# EAGLE board omicron2 (EAGLE 6.3)
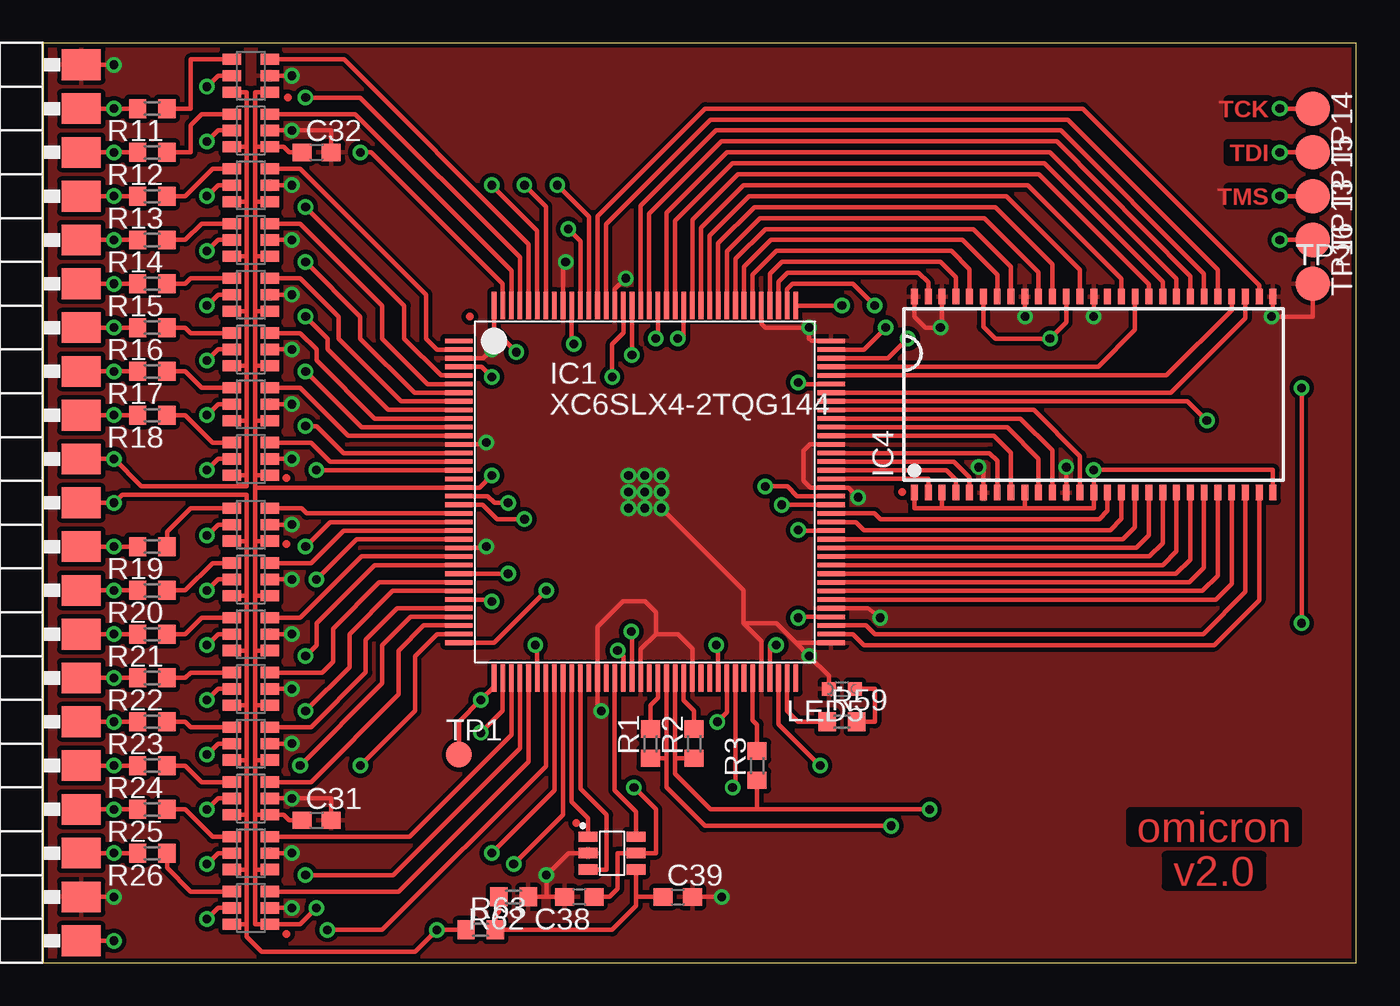
[diagram p5: board, top side]
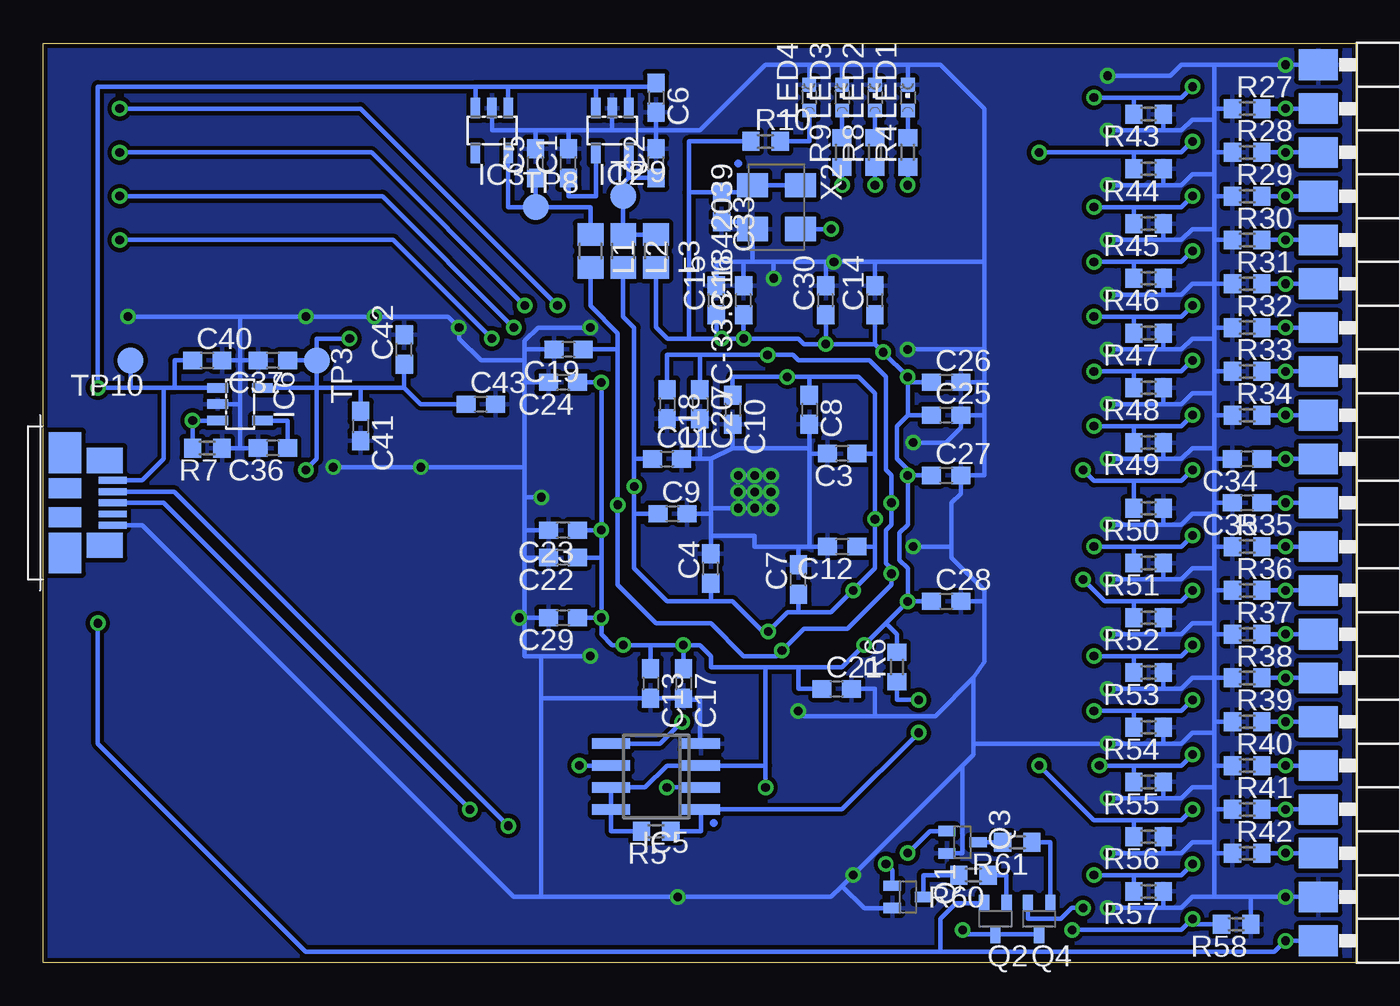
[diagram p6: board, bottom side, seen from below]

Size 76.19 x 53.33 mm. Coordinates in mm from the lower left corner, seen from the top.
Outline: 76.19,0 76.19,53.33 0,53.33 0,0 76.19,0
Copper layers (1*16): Top 0.035mm / dielectric 1.5mm / Bottom 0.035mm
Design rules "default *": minimum track width 0.2mm, minimum drill 0.5mm, track to track 0.2mm, track to pad 0.2mm, pad to pad 0.2mm, via to via 0.2mm, smd to smd 0mil, copper to edge 0.2mm, drill to drill 8mil, minimum pad ring 0.2mm, minimum via ring 0.2mm, stop-mask expansion 4mil, vias tented up to drill 1mm, thermal gap 10mil

## Footprints (pad centres in the part's own frame; a part is rotated, then mirrored left to right if it is on the bottom)
C0603 = smd 1.1 x 1: 1 -0.85,0; 2 0.85,0
TQG144 = smd 1.6 x 0.27: 1 -10.8,8.75; 2 -10.8,8.25; 3 -10.8,7.75; 4 -10.8,7.25; 5 -10.8,6.75; 6 -10.8,6.25; 7 -10.8,5.75; 8 -10.8,5.25; 9 -10.8,4.75; 10 -10.8,4.25; 11 -10.8,3.75; 12 -10.8,3.25; 13 -10.8,2.75; 14 -10.8,2.25; 15 -10.8,1.75; 16 -10.8,1.25; 17 -10.8,0.75; 18 -10.8,0.25; 19 -10.8,-0.25; 20 -10.8,-0.75; 21 -10.8,-1.25; 22 -10.8,-1.75; 23 -10.8,-2.25; 24 -10.8,-2.75; 25 -10.8,-3.25; 26 -10.8,-3.75; 27 -10.8,-4.25; 28 -10.8,-4.75; 29 -10.8,-5.25; 30 -10.8,-5.75; 31 -10.8,-6.25; 32 -10.8,-6.75; 33 -10.8,-7.25; 34 -10.8,-7.75; 35 -10.8,-8.25; 36 -10.8,-8.75; 73 10.8,-8.75; 74 10.8,-8.25; 75 10.8,-7.75; 76 10.8,-7.25; 77 10.8,-6.75; 78 10.8,-6.25; 79 10.8,-5.75; 80 10.8,-5.25; 81 10.8,-4.75; 82 10.8,-4.25; 83 10.8,-3.75; 84 10.8,-3.25; 85 10.8,-2.75; 86 10.8,-2.25; 87 10.8,-1.75; 88 10.8,-1.25; 89 10.8,-0.75; 90 10.8,-0.25; 91 10.8,0.25; 92 10.8,0.75; 93 10.8,1.25; 94 10.8,1.75; 95 10.8,2.25; 96 10.8,2.75; 97 10.8,3.25; 98 10.8,3.75; 99 10.8,4.25; 100 10.8,4.75; 101 10.8,5.25; 102 10.8,5.75; 103 10.8,6.25; 104 10.8,6.75; 105 10.8,7.25; 106 10.8,7.75; 107 10.8,8.25; 108 10.8,8.75 | smd 0.27 x 1.6: 37 -8.75,-10.8; 38 -8.25,-10.8; 39 -7.75,-10.8; 40 -7.25,-10.8; 41 -6.75,-10.8; 42 -6.25,-10.8; 43 -5.75,-10.8; 44 -5.25,-10.8; 45 -4.75,-10.8; 46 -4.25,-10.8; 47 -3.75,-10.8; 48 -3.25,-10.8; 49 -2.75,-10.8; 50 -2.25,-10.8; 51 -1.75,-10.8; 52 -1.25,-10.8; 53 -0.75,-10.8; 54 -0.25,-10.8; 55 0.25,-10.8; 56 0.75,-10.8; 57 1.25,-10.8; 58 1.75,-10.8; 59 2.25,-10.8; 60 2.75,-10.8; 61 3.25,-10.8; 62 3.75,-10.8; 63 4.25,-10.8; 64 4.75,-10.8; 65 5.25,-10.8; 66 5.75,-10.8; 67 6.25,-10.8; 68 6.75,-10.8; 69 7.25,-10.8; 70 7.75,-10.8; 71 8.25,-10.8; 72 8.75,-10.8; 109 8.75,10.8; 110 8.25,10.8; 111 7.75,10.8; 112 7.25,10.8; 113 6.75,10.8; 114 6.25,10.8; 115 5.75,10.8; 116 5.25,10.8; 117 4.75,10.8; 118 4.25,10.8; 119 3.75,10.8; 120 3.25,10.8; 121 2.75,10.8; 122 2.25,10.8; 123 1.75,10.8; 124 1.25,10.8; 125 0.75,10.8; 126 0.25,10.8; 127 -0.25,10.8; 128 -0.75,10.8; 129 -1.25,10.8; 130 -1.75,10.8; 131 -2.25,10.8; 132 -2.75,10.8; 133 -3.25,10.8; 134 -3.75,10.8; 135 -4.25,10.8; 136 -4.75,10.8; 137 -5.25,10.8; 138 -5.75,10.8; 139 -6.25,10.8; 140 -6.75,10.8; 141 -7.25,10.8; 142 -7.75,10.8; 143 -8.25,10.8; 144 -8.75,10.8
SOT23-DBV = smd 0.55 x 1.2: 1 -0.95,-1.3; 2 0,-1.3; 3 0.95,-1.3; 4 0.95,1.3; 5 -0.95,1.3
TSOP54-400 = smd 0.4 x 0.9: 1 -10.4,-5.68; 2 -9.6,-5.68; 3 -8.8,-5.68; 4 -8,-5.68; 5 -7.2,-5.68; 6 -6.4,-5.68; 7 -5.6,-5.68; 8 -4.8,-5.68; 9 -4,-5.68; 10 -3.2,-5.68; 11 -2.4,-5.68; 12 -1.6,-5.68; 13 -0.8,-5.68; 14 0,-5.68; 15 0.8,-5.68; 16 1.6,-5.68; 17 2.4,-5.68; 18 3.2,-5.68; 19 4,-5.68; 20 4.8,-5.68; 21 5.6,-5.68; 22 6.4,-5.68; 23 7.2,-5.68; 24 8,-5.68; 25 8.8,-5.68; 26 9.6,-5.68; 27 10.4,-5.68; 28 10.4,5.68; 29 9.6,5.68; 30 8.8,5.68; 31 8,5.68; 32 7.2,5.68; 33 6.4,5.68; 34 5.6,5.68; 35 4.8,5.68; 36 4,5.68; 37 3.2,5.68; 38 2.4,5.68; 39 1.6,5.68; 40 0.8,5.68; 41 0,5.68; 42 -0.8,5.68; 43 -1.6,5.68; 44 -2.4,5.68; 45 -3.2,5.68; 46 -4,5.68; 47 -4.8,5.68; 48 -5.6,5.68; 49 -6.4,5.68; 50 -7.2,5.68; 51 -8,5.68; 52 -8.8,5.68; 53 -9.6,5.68; 54 -10.4,5.68
SO8 = smd 0.6 x 2.2: 1 -1.905,-2.6; 2 -0.635,-2.6; 3 0.635,-2.6; 4 1.905,-2.6; 5 1.905,2.6; 6 0.635,2.6; 7 -0.635,2.6; 8 -1.905,2.6
PINH1X01SMD = smd 1.778 x 2.286: 1 0,-2.223
R0805 = smd 1.3 x 1.5: 1 -0.95,0; 2 0.95,0
CHIPLED_0603 = smd 0.8 x 0.8: A 0,-0.75; C 0,0.75
SOT323 = smd 0.6 x 1: 1 -0.65,-0.9; 2 0.65,-0.9; 3 0,0.9
SOT323-BEC = smd 0.6 x 1: 1 -0.65,-0.9; 2 0.65,-0.9; 3 0,0.9
R0603 = smd 1 x 1.1: 1 -0.85,0; 2 0.85,0
TP15R = smd 1.5 x 1.5: TP 0,0
TP20R = smd 2 x 2: TP 0,0
SOT236 = smd 0.65 x 1.06: 1 -0.95,-1.1; 2 0,-1.1; 3 0.95,-1.1; 4 0.95,1.1; 5 0,1.1; 6 -0.95,1.1
SOT23 = smd 0.6 x 1.1: 1 -0.95,-1.4; 2 0,-1.4; 3 0.95,-1.4; 4 0.95,1.4; 5 0,1.4; 6 -0.95,1.4
USB-MICRO-B-BOTTOM-MOLEX = smd 1.6 x 0.4: 1 2.77,1.3; 2 2.77,0.65; 3 2.77,0; 4 2.77,-0.65; 5 2.77,-1.3 | smd 1.9 x 2.375: S@1 0,2.913; S@4 0,-2.913 | smd 1.9 x 1.175: S@2 0,0.838; S@3 0,-0.838 | smd 2.1 x 1.475: S@5 2.3,2.462; S@6 2.3,-2.462
5X3.2_HAND = smd 1.4 x 1.8: 1 -1.27,-1.4; 2 1.27,-1.4; 3 1.27,1.4; 4 -1.27,1.4

## Placement (x,y rotation side)
C1  10uF  [C0603]  45.71,46.35 90 bottom
C2  2.2uF  [C0603]  40.63,46.35 90 bottom
C3  4.7uF  [C0603]  29.83,29.53 180 bottom
C4  4.7uF  [C0603]  37.46,22.86 90 bottom
C5  1uF  [C0603]  47.62,46.35 90 bottom
C6  2.2uF  [C0603]  40.63,50.16 270 bottom
C7  4.7uF  [C0603]  32.38,22.23 90 bottom
C8  4.7uF  [C0603]  31.74,32.07 270 bottom
C9  4.7uF  [C0603]  39.68,26.04 0 bottom
C10  4.7uF  [C0603]  36.19,32.07 270 bottom
C11  4.7uF  [C0603]  40,29.21 0 bottom
C12  470nF  [C0603]  29.83,24.13 180 bottom
C13  4.7uF  [C0603]  40.95,16.19 270 bottom
C14  4.7uF  [C0603]  27.93,38.42 90 bottom
C15  470nF  [C0603]  37.14,38.42 90 bottom
C16  470nF  [C0603]  35.55,38.42 90 bottom
C17  470nF  [C0603]  39.04,16.19 270 bottom
C18  4.7uF  [C0603]  40,32.38 270 bottom
C19  4.7uF  [C0603]  45.71,35.56 180 bottom
C20  470nF  [C0603]  38.09,32.38 270 bottom
C21  470nF  [C0603]  30.15,15.88 0 bottom
C22  4.7uF  [C0603]  46.03,23.5 180 bottom
C23  470nF  [C0603]  46.03,25.08 180 bottom
C24  470nF  [C0603]  46.03,33.66 180 bottom
C25  4.7uF  [C0603]  23.8,31.75 0 bottom
C26  470nF  [C0603]  23.8,33.66 0 bottom
C27  470nF  [C0603]  23.8,28.26 0 bottom
C28  470nF  [C0603]  23.8,20.95 0 bottom
C29  470nF  [C0603]  46.03,20 180 bottom
C30  470nF  [C0603]  30.79,38.42 90 bottom
C31  470nF  [C0603]  15.87,8.26 0 top
C32  470nF  [C0603]  15.87,46.99 0 top
C33  470nF  [C0603]  36.82,43.81 270 bottom
C34  [C0603]  6.34,29.21 180 bottom
C35  [C0603]  6.34,26.67 180 bottom
C36  10uF  [C0603]  62.86,29.84 180 bottom
C37  2.2uF  [C0603]  62.86,34.92 180 bottom
C38  470nF  [C0603]  31.1,3.81 180 top
C39  470nF  [C0603]  36.82,3.81 0 top
C40  2.2uF  [C0603]  66.66,34.92 0 bottom
C41  470nF  [C0603]  57.77,31.11 270 bottom
C42  470nF  [C0603]  55.23,35.56 90 bottom
C43  470nF  [C0603]  50.79,32.38 0 bottom
IC1  XC6SLX4-2TQG144  [TQG144]  34.91,27.3 0 top
IC2  TPS73033DBV  [SOT23-DBV]  43.17,48.26 180 bottom
IC3  LD6806TD/12H  [SOT23-DBV]  50.16,48.26 180 bottom
IC4  MT48LC64M4A2  [TSOP54-400]  60.95,32.94 0 top
IC5  M25P40-2253716  [SO8]  40.63,10.79 90 bottom
IC6  TPS73033DBV  [SOT23-DBV]  64.76,32.38 270 bottom
JP1  PINH1X01SMD  [PINH1X01SMD]  -0.01,26.67 270 bottom
JP2  PINH1X01SMD  [PINH1X01SMD]  -0.01,26.67 90 top
JP3  PINH1X01SMD  [PINH1X01SMD]  -0.01,29.21 270 bottom
JP4  PINH1X01SMD  [PINH1X01SMD]  -0.01,29.21 90 top
JP5  PINH1X01SMD  [PINH1X01SMD]  -0.01,3.81 270 bottom
JP6  PINH1X01SMD  [PINH1X01SMD]  -0.01,3.81 90 top
JP7  PINH1X01SMD  [PINH1X01SMD]  -0.01,52.07 270 bottom
JP8  PINH1X01SMD  [PINH1X01SMD]  -0.01,52.07 90 top
JP9  PINH1X01SMD  [PINH1X01SMD]  -0.01,1.27 90 top
JP10  PINH1X01SMD  [PINH1X01SMD]  -0.01,1.27 270 bottom
JP97  PINH1X01SMD  [PINH1X01SMD]  -0.01,24.13 90 top
JP98  PINH1X01SMD  [PINH1X01SMD]  -0.01,24.13 270 bottom
JP99  PINH1X01SMD  [PINH1X01SMD]  -0.01,21.59 270 bottom
JP100  PINH1X01SMD  [PINH1X01SMD]  -0.01,21.59 90 top
JP101  PINH1X01SMD  [PINH1X01SMD]  -0.01,19.05 270 bottom
JP102  PINH1X01SMD  [PINH1X01SMD]  -0.01,19.05 90 top
JP103  PINH1X01SMD  [PINH1X01SMD]  -0.01,16.51 270 bottom
JP104  PINH1X01SMD  [PINH1X01SMD]  -0.01,16.51 90 top
JP105  PINH1X01SMD  [PINH1X01SMD]  -0.01,13.97 270 bottom
JP106  PINH1X01SMD  [PINH1X01SMD]  -0.01,13.97 90 top
JP107  PINH1X01SMD  [PINH1X01SMD]  -0.01,11.43 270 bottom
JP108  PINH1X01SMD  [PINH1X01SMD]  -0.01,11.43 90 top
JP109  PINH1X01SMD  [PINH1X01SMD]  -0.01,8.89 270 bottom
JP110  PINH1X01SMD  [PINH1X01SMD]  -0.01,8.89 90 top
JP111  PINH1X01SMD  [PINH1X01SMD]  -0.01,6.35 270 bottom
JP112  PINH1X01SMD  [PINH1X01SMD]  -0.01,6.35 90 top
JP113  PINH1X01SMD  [PINH1X01SMD]  -0.01,49.53 270 bottom
JP114  PINH1X01SMD  [PINH1X01SMD]  -0.01,49.53 90 top
JP115  PINH1X01SMD  [PINH1X01SMD]  -0.01,46.99 270 bottom
JP116  PINH1X01SMD  [PINH1X01SMD]  -0.01,46.99 90 top
JP117  PINH1X01SMD  [PINH1X01SMD]  -0.01,44.45 270 bottom
JP118  PINH1X01SMD  [PINH1X01SMD]  -0.01,44.45 90 top
JP119  PINH1X01SMD  [PINH1X01SMD]  -0.01,41.91 270 bottom
JP120  PINH1X01SMD  [PINH1X01SMD]  -0.01,41.91 90 top
JP121  PINH1X01SMD  [PINH1X01SMD]  -0.01,39.37 270 bottom
JP122  PINH1X01SMD  [PINH1X01SMD]  -0.01,39.37 90 top
JP123  PINH1X01SMD  [PINH1X01SMD]  -0.01,36.83 270 bottom
JP124  PINH1X01SMD  [PINH1X01SMD]  -0.01,36.83 90 top
JP125  PINH1X01SMD  [PINH1X01SMD]  -0.01,34.29 270 bottom
JP126  PINH1X01SMD  [PINH1X01SMD]  -0.01,34.29 90 top
JP127  PINH1X01SMD  [PINH1X01SMD]  -0.01,31.75 270 bottom
JP128  PINH1X01SMD  [PINH1X01SMD]  -0.01,31.75 90 top
L1  [R0805]  44.44,41.27 270 bottom
L2  [R0805]  42.54,41.27 270 bottom
L3  [R0805]  40.63,41.27 270 bottom
LED1  ORANGE-1710526  [CHIPLED_0603]  26.02,50.16 0 bottom
LED2  ORANGE-1710526  [CHIPLED_0603]  27.93,50.16 0 bottom
LED3  ORANGE-1710526  [CHIPLED_0603]  29.83,50.16 0 bottom
LED4  GREEN-1226372  [CHIPLED_0603]  31.74,50.16 0 bottom
LED5  RED  [CHIPLED_0603]  46.34,15.88 90 top
Q1  [SOT323]  26.02,3.81 270 bottom
Q2  BC807W  [SOT323-BEC]  20.94,2.54 180 bottom
Q3  [SOT323]  22.85,6.99 270 bottom
Q4  BC807W  [SOT323-BEC]  18.4,2.54 180 bottom
R1  27  [R0603]  35.23,12.7 90 top
R2  27  [R0603]  37.77,12.7 90 top
R3  1k5  [R0603]  41.42,11.43 90 top
R4  68  [R0603]  26.02,46.99 90 bottom
R5  47k  [R0603]  40.63,7.62 180 bottom
R6  4k7  [R0603]  26.66,17.14 90 bottom
R7  47k  [R0603]  66.66,29.84 180 bottom
R8  68  [R0603]  27.93,46.99 90 bottom
R9  68  [R0603]  29.83,46.99 90 bottom
R10  68  [R0603]  34.28,47.62 0 bottom
R11  [R0603]  6.34,49.53 180 top
R12  [R0603]  6.34,46.99 180 top
R13  [R0603]  6.34,44.45 180 top
R14  [R0603]  6.34,41.91 180 top
R15  [R0603]  6.34,39.37 180 top
R16  [R0603]  6.34,36.83 180 top
R17  [R0603]  6.34,34.29 180 top
R18  [R0603]  6.34,31.75 180 top
R19  [R0603]  6.34,24.13 180 top
R20  [R0603]  6.34,21.59 180 top
R21  [R0603]  6.34,19.05 180 top
R22  [R0603]  6.34,16.51 180 top
R23  [R0603]  6.34,13.97 180 top
R24  [R0603]  6.34,11.43 180 top
R25  [R0603]  6.34,8.89 180 top
R26  [R0603]  6.34,6.35 180 top
R27  [R0603]  6.34,49.53 0 bottom
R28  [R0603]  6.34,46.99 0 bottom
R29  [R0603]  6.34,44.45 0 bottom
R30  [R0603]  6.34,41.91 0 bottom
R31  [R0603]  6.34,39.37 0 bottom
R32  [R0603]  6.34,36.83 0 bottom
R33  [R0603]  6.34,34.29 0 bottom
R34  [R0603]  6.34,31.75 0 bottom
R35  [R0603]  6.34,24.13 0 bottom
R36  [R0603]  6.34,21.59 0 bottom
R37  [R0603]  6.34,19.05 0 bottom
R38  [R0603]  6.34,16.51 0 bottom
R39  [R0603]  6.34,13.97 0 bottom
R40  [R0603]  6.34,11.43 0 bottom
R41  [R0603]  6.34,8.89 0 bottom
R42  [R0603]  6.34,6.35 0 bottom
R43  [R0603]  12.05,49.21 180 bottom
R44  [R0603]  12.05,46.04 180 bottom
R45  [R0603]  12.05,42.86 180 bottom
R46  [R0603]  12.05,39.69 180 bottom
R47  [R0603]  12.05,36.51 180 bottom
R48  [R0603]  12.05,33.34 180 bottom
R49  [R0603]  12.05,30.16 180 bottom
R50  [R0603]  12.05,26.35 180 bottom
R51  [R0603]  12.05,23.18 180 bottom
R52  [R0603]  12.05,20 180 bottom
R53  [R0603]  12.05,16.83 180 bottom
R54  [R0603]  12.05,13.65 180 bottom
R55  [R0603]  12.05,10.48 180 bottom
R56  [R0603]  12.05,7.3 180 bottom
R57  [R0603]  12.05,4.13 180 bottom
R58  [R0603]  6.98,2.22 180 bottom
R59  68  [R0603]  46.34,13.97 0 top
R60  6k8 1%  [R0603]  22.21,5.08 180 bottom
R61  6k8 1%  [R0603]  19.67,6.99 180 bottom
R62  68  [R0603]  27.29,3.81 180 top
R63  68  [R0603]  25.39,1.91 0 top
TP1  TPTP15R  [TP15R]  24.12,12.06 0 top
TP2  TPTP20R  [TP20R]  73.65,39.37 0 top
TP3  TPTP15R  [TP15R]  60.32,34.92 270 bottom
TP8  TPTP15R  [TP15R]  47.62,43.81 0 bottom
TP9  TPTP15R  [TP15R]  42.54,44.45 0 bottom
TP10  TPTP15R  [TP15R]  71.11,34.92 180 bottom
TP13  TPTP20R  [TP20R]  73.65,44.45 270 top
TP14  TPTP20R  [TP20R]  73.65,49.53 270 top
TP15  TPTP20R  [TP20R]  73.65,46.99 270 top
TP16  TPTP20R  [TP20R]  73.65,41.91 270 top
TR1  [SOT236]  12.05,51.44 90 top
TR2  [SOT236]  12.05,48.26 90 top
TR3  [SOT236]  12.05,45.09 90 top
TR4  [SOT236]  12.05,41.91 90 top
TR5  [SOT236]  12.05,38.73 90 top
TR6  [SOT236]  12.05,35.56 90 top
TR7  [SOT236]  12.05,32.38 90 top
TR8  [SOT236]  12.05,29.21 90 top
TR9  [SOT236]  12.05,25.4 90 top
TR10  [SOT236]  12.05,22.23 90 top
TR11  [SOT236]  12.05,19.05 90 top
TR12  [SOT236]  12.05,15.88 90 top
TR13  [SOT236]  12.05,12.7 90 top
TR14  [SOT236]  12.05,9.53 90 top
TR15  [SOT236]  12.05,6.35 90 top
TR16  [SOT236]  12.05,3.17 90 top
U$1  PIC10F320  [SOT23]  33.01,6.35 270 top
X1  USB-MICRO-B-BOTTOM  [USB-MICRO-B-BOTTOM-MOLEX]  74.92,26.67 0 bottom
X2  7C-33.3-1842039  [5X3.2_HAND]  33.65,43.81 270 bottom

## Tracks (layer width: path | path; a pad name or v marks a point on that pad's centre or on a via)
+3V3  (via drill 0.5)
  Top 0.254: IC1.135 30.66,35.84 v30.79,35.88 | IC1.125 35.66,36.31 v35.55,36.2 | IC1.103 43.91,33.55 v43.8,33.66 | IC1.86 43.83,25.05 v43.8,25.08 | IC1.76 43.86,20.05 v43.8,20 | v28.56,18.41 28.66,18.32 IC1.42 28.66,17.78 | IC1.63 39.16,18.29 v39.04,18.41 | IC1.31 25.92,21.05 v26.02,20.95 | v26.02,28.26 25.32,27.55 IC1.18 12.29,27.55 | IC1.69 42.16,18.41 v42.54,18.41 | IC1.4 25.44,34.55 v26.02,33.97 | IC1.122 37.16,36.2 v36.82,36.2 | 12.29,5.4 12.29,2.23 TR16.1 14.92,2.23 v15.87,3.17 | TR15.1 12.29,5.4 | 12.29,8.57 TR14.1 13.96,8.57 14.28,8.26 C31.1 | 12.29,8.57 12.29,5.4 | TR13.1 12.29,11.75 | 12.29,11.75 12.29,8.57 | TR12.1 12.29,14.93 | 12.29,14.93 12.29,11.75 | TR11.1 12.29,18.1 | 12.29,18.1 12.29,14.93 | TR10.1 12.29,21.27 | 12.29,21.27 12.29,18.1 | 12.29,24.45 12.29,21.27 | TR8.1 12.29,28.26 | TR7.1 12.29,31.43 | 12.29,31.43 12.29,28.26 | TR6.1 12.29,34.61 | 12.29,34.61 12.29,31.43 | TR5.1 12.29,37.78 | 12.29,37.78 12.29,34.61 | TR4.1 12.29,40.96 | 12.29,40.96 12.29,37.78 | TR3.1 12.29,44.13 | 12.29,44.13 12.29,40.96 | 12.29,47.31 TR2.1 13.96,47.31 14.28,46.99 C32.1 | 12.29,47.31 12.29,44.13 | TR1.1 12.29,50.48 12.29,47.31 | IC1.144 26.16,36.69 v27.45,35.4 | TR9.1 12.29,24.45 | 12.29,24.45 12.29,27.55 | 12.29,27.55 12.29,28.26 | C38.1 32.85,3.81 33.33,4.29 33.33,6.35 U$1.5 35.55,6.35 35.55,8.89 v34.28,10.16
  Bottom 0.254: v30.79,35.88 C30.1 | v35.55,36.2 C16.1 | C24.1 v43.8,33.66 v43.8,25.08 | v43.8,25.08 C23.1 | v39.04,18.41 C17.1 | v26.02,20.95 C28.1 | v26.02,20.95 27.29,19.68 | 27.29,19.68 v28.56,18.41 29.83,17.14 32.38,17.14 | v26.02,33.97 26.02,33.66 | 26.02,33.66 26.02,31.75 | 40.95,18.41 v42.54,18.41 43.17,18.41 43.8,19.05 v43.8,20 | 40.95,18.41 v39.04,18.41 | v43.8,25.08 43.8,23.5 | 43.8,23.5 v43.8,20 | C25.1 26.02,31.75 | C22.1 43.8,23.5 | C26.1 26.02,33.66 | R5.2 43.23,7.62 IC5.8 IC5.7 41.27,10.16 40,11.43 IC5.3 34.28,11.43 | v39.04,18.41 38.09,18.41 37.46,17.78 37.46,17.14 34.28,17.14 | 26.02,34.29 v26.02,33.97 | v26.02,28.26 26.02,28.57 26.66,29.21 26.66,31.11 26.02,31.75 | v26.02,20.95 26.02,22.86 26.5,23.34 26.5,24.92 26.02,25.4 v26.02,28.26 | v30.79,35.88 32.06,35.88 32.38,36.2 v35.55,36.2 | v30.79,35.88 27.93,35.88 | 27.93,35.88 v27.45,35.4 v26.02,33.97 | C27.1 v26.02,28.26 | v35.55,36.2 v36.82,36.2 37.14,36.2 | C15.1 37.14,36.2 | 37.14,36.2 38.73,36.2 | 38.73,36.2 39.97,36.2 40.63,36.86 L3.2 | v43.8,20 C29.1 | X2.4 X2.1 35.05,44.66 C33.1 38.73,44.66 | C13.1 40.95,18.41 | 34.28,11.43 34.28,17.14 | C14.1 27.93,35.88 | 38.73,44.66 38.73,47.62 R10.1 | 38.73,44.66 38.73,36.2 | 34.28,17.14 32.38,17.14 | C21.1 32.38,15.88 32.38,17.14 | R6.2 26.66,19.05 27.29,19.68 | Q4.2 19.05,2.54 17.13,2.54 16.5,3.17 v15.87,3.17 | v34.28,10.16 34.28,11.43
+5V  (via drill 0.5)
  Top 0.254: JP9.1 v4.12,1.27 | v73.02,19.68 v73.02,33.34
  Bottom 0.254: JP9.1 v4.12,1.27 4.75,0.64 24.12,0.64 | IC3.1 49.21,50.8 | 49.21,50.8 51.11,50.8 | IC2.3 44.12,50.8 | 44.12,50.8 49.21,50.8 | IC2.1 42.22,50.8 | 42.22,50.8 44.12,50.8 | C6.1 40.63,50.8 42.22,50.8 | X1.1 70.44,27.97 69.2,29.21 69.2,33.34 | 68.57,33.34 69.2,33.34 | IC6.1 68.57,33.34 | 69.2,33.34 71.11,33.34 | 71.11,33.34 v73.02,33.34 73.02,50.8 51.11,50.8 | 51.11,50.8 IC3.3 | 24.12,0.64 60.95,0.64 73.02,12.7 v73.02,19.68 | TP10.TP 71.11,33.34 | C40.1 68.57,34.92 68.57,33.34 | Q2.2 23.22,3.44 24.12,2.54 24.12,0.64
AD_RA0
  Top 0.254: IC1.46 30.66,9.33 31.61,8.38 U$1.1
AD_RA1
  Top 0.254: U$1.3 32.69,5.4 32.69,8.57 31.16,10.1 IC1.47
AD_RA3
  Top 0.254: IC1.51 33.16,10.01 34.41,8.76 U$1.6
CFG_DONE
  Top 0.254: IC1.71 43.16,14.61 43.8,13.97 R59.1
CLK_33  (via drill 0.5)
  Top 0.254: IC1.134 31.16,41.85 v30.47,42.55
  Bottom 0.254: v30.47,42.55 X2.3
FLASH_CLK  (via drill 0.5)
  Top 0.254: IC1.70 42.66,13.84 v45.08,11.43
  Bottom 0.254: v45.08,11.43 IC5.6
FLASH_CS  (via drill 0.5)
  Top 0.254: IC1.38 26.66,14.61 v25.39,13.34
  Bottom 0.254: R5.1 38.03,7.62 IC5.1 29.83,8.89 v25.39,13.34
FLASH_SI  (via drill 0.5)
  Top 0.254: IC1.64 39.66,14.53 v39.12,13.97
  Bottom 0.254: IC5.5 40.39,12.7 v39.12,13.97
FLASH_SO  (via drill 0.5)
  Top 0.254: IC1.65 40.16,10.33 v40,10.16
  Bottom 0.254: IC5.2 v40,10.16
GND  (via drill 0.5)
  Top 0.254: IC1.3 25.52,35.05 v26.02,35.56 | IC1.13 25.6,30.05 v25.71,30.16 | IC1.25 25.63,24.05 v25.71,24.13 | IC1.60 37.66,18.2 36.82,19.05 35.55,19.05 | IC1.68 41.66,18.65 40.63,19.68 | 43.66,18.55 v44.44,17.78 45.59,16.62 LED5.C | 43.66,18.55 42.54,19.68 40.63,19.68 | IC1.73 43.66,18.55 | v47.3,26.99 46.73,27.55 IC1.91 44.51,27.55 44.12,27.94 44.12,29.69 44.49,30.05 IC1.96 | IC1.108 44.58,36.05 44.44,36.2 v44.44,36.83 41.9,36.83 41.66,37.06 IC1.113 | IC1.130 33.16,39.05 v33.8,39.69 | IC1.54 34.66,18.16 35.55,19.05 | IC1.77 47.85,20.55 v48.57,20 | TR1.2 v14.44,51.44 | TR2.2 v14.44,48.26 16.71,48.26 C32.2 | JP6.1 v4.12,3.81 | v4.12,52.07 JP8.1 | TR3.2 v14.44,45.09 | TR4.2 v14.44,41.91 | TR5.2 v14.44,38.73 | TR6.2 v14.44,35.56 | TR7.2 v14.44,32.38 | TR8.2 v14.44,29.21 | TR9.2 v14.44,25.4 | TR10.2 v14.44,22.23 | TR11.2 v14.44,19.05 | TR12.2 v14.44,15.88 | TR13.2 v14.44,12.7 | TR14.2 v14.44,9.53 16.71,9.53 C31.2 | TR15.2 v14.44,6.35 | TR16.2 v14.44,3.17 | IC4.46 56.95,37.47 v56.98,37.47 | IC4.41 v60.95,37.47 | IC4.54 50.55,37.47 51.19,36.83 v52.06,36.83 52.15,36.92 IC4.52 | IC4.28 71.35,37.47 v71.27,37.47 73.65,37.47 TP2.TP | IC4.12 v59.35,28.73 v59.36,28.73 | 40.63,19.68 40.63,21.59 v35.87,26.35 | 35.55,19.05 35.55,20.32 34.91,20.95 33.65,20.95 32.16,19.48 IC1.49 32.16,14.81 v32.38,14.61 | IC4.6 54.55,28.47 v54.28,28.73 | IC1.136 30.16,40.49 v30.31,40.64 | U$1.2 30.47,6.35 v29.2,5.08 29.2,3.81 | R62.1 29.2,3.81 | C38.2 29.2,3.81 | C39.2 v39.36,3.81
  Bottom 0.254: C7.2 32.38,24.13 | 32.38,24.13 31.74,24.13 | 31.74,24.13 C12.2 | 31.74,29.53 31.74,24.13 | C3.2 31.74,29.53 | C8.2 31.74,29.84 | 31.74,29.84 31.74,29.53 | 36.19,29.84 31.74,29.84 | C10.2 36.19,29.84 | 36.19,29.84 37.46,29.21 | 37.46,29.21 38.09,29.21 | 38.09,29.21 C11.2 | 37.46,26.35 37.46,29.21 | v35.87,26.35 37.46,26.35 | 48.25,23.5 48.25,25.08 | C23.2 48.25,25.08 | 48.25,35.56 48.25,36.05 47.48,36.83 v44.44,36.83 | 48.25,35.56 48.25,34.92 | 48.25,34.92 48.25,33.66 | C24.2 48.25,33.66 | 48.25,33.66 48.25,28.73 | 48.25,28.73 48.25,26.99 | 48.25,26.99 48.25,25.08 | C16.2 35.55,40.64 | 35.05,40.64 37.14,40.64 C15.2 | 30.79,40.64 33.8,40.64 | 33.8,40.64 35.05,40.64 | C30.2 30.79,40.64 | C28.2 21.58,20.95 | 21.58,31.75 C25.2 22.95,31.01 23.8,30.16 v25.71,30.16 | 21.58,31.75 21.58,28.26 C27.2 22.95,27.2 23.48,26.67 23.48,24.13 | C26.2 21.58,33.66 | 21.58,33.66 21.58,31.75 | 22.21,16.51 21.58,17.46 21.58,20.95 | v35.87,26.35 v35.87,27.3 | v35.87,27.3 v35.87,28.26 v34.91,28.26 v33.96,28.26 | v35.87,26.35 v34.91,26.35 v33.96,26.35 | v35.87,27.3 v34.91,27.3 v33.96,27.3 | v44.44,17.78 47.3,17.78 | C22.2 48.25,23.5 | v47.3,26.99 48.25,26.99 | v33.8,39.69 33.8,40.64 | 22.21,16.51 24.44,14.29 27.93,14.29 | 21.58,33.66 21.58,35.56 | 21.58,35.56 21.58,40.64 | 21.58,40.64 27.93,40.64 | 27.93,40.64 v30.31,40.64 30.79,40.64 | 47.3,17.78 47.3,15.24 | 48.25,20 48.25,17.78 47.3,17.78 | C29.2 48.25,20 | R42.1 8.25,6.35 | 8.25,6.35 8.25,6.99 | 8.25,6.99 8.25,8.89 | 8.25,8.89 R41.1 | R40.1 8.25,11.43 | 8.25,11.43 8.25,10.16 | 8.25,10.16 8.25,8.89 | R39.1 8.25,13.97 | 8.25,13.97 8.25,13.34 | 8.25,13.34 8.25,11.43 | R38.1 8.25,16.51 | 8.25,16.51 8.25,13.97 | R37.1 8.25,19.05 | 8.25,19.05 8.25,16.51
  Bottom 0.254: R36.1 8.25,21.59 | 8.25,21.59 8.25,19.68 | 8.25,19.68 8.25,19.05 | R35.1 8.25,24.13 | 8.25,24.13 8.25,22.86 | 8.25,22.86 8.25,21.59 | R33.1 8.25,34.29 | 8.25,34.29 8.25,33.02 | 8.25,33.02 8.25,31.75 | 8.25,31.75 8.25,29.84 | 8.25,29.84 8.25,29.21 | 8.25,29.21 8.25,26.67 | 8.25,26.67 8.25,26.04 | 8.25,26.04 8.25,24.13 | R34.1 8.25,31.75 | R32.1 8.25,36.83 | 8.25,36.83 8.25,36.2 | 8.25,36.2 8.25,34.29 | R31.1 8.25,39.37 | 8.25,39.37 8.25,36.83 | R30.1 8.25,41.91 | 8.25,41.91 8.25,39.37 | R29.1 8.25,44.45 | 8.25,44.45 8.25,42.55 | 8.25,42.55 8.25,41.91 | R28.1 8.25,46.99 | 8.25,46.99 8.25,45.72 | 8.25,45.72 8.25,44.45 | R27.1 8.25,49.53 | 8.25,49.53 8.25,48.9 | 8.25,48.9 8.25,46.99 | C35.2 8.25,26.67 | C34.2 8.25,29.21 | 8.25,52.07 8.25,49.53 | 8.25,3.81 8.25,6.35 | v14.44,51.44 10.79,51.44 10.15,52.07 8.25,52.07 | JP6.1 v4.12,3.81 6.12,3.81 | 6.12,3.81 8.25,3.81 | JP8.1 v4.12,52.07 8.25,52.07 | v14.44,48.26 11.21,48.26 | 11.21,48.26 10.15,48.26 9.52,48.9 8.25,48.9 | v14.44,45.09 11.21,45.09 | 11.21,45.09 10.15,45.09 9.52,45.72 8.25,45.72 | v14.44,41.91 11.21,41.91 | 11.21,41.91 10.15,41.91 9.52,42.55 8.25,42.55 | v14.44,38.73 11.21,38.73 | 11.21,38.73 10.15,38.73 9.52,39.37 8.25,39.37 | v14.44,35.56 11.21,35.56 | 11.21,35.56 10.15,35.56 9.52,36.2 8.25,36.2 | v14.44,32.38 11.21,32.38 | 11.21,32.38 10.15,32.38 9.52,33.02 8.25,33.02 | v14.44,29.21 11.21,29.21 | 11.21,29.21 10.15,29.21 9.52,29.84 8.25,29.84 | v14.44,25.4 11.21,25.4 | 11.21,25.4 10.15,25.4 9.52,26.04 8.25,26.04 | v14.44,22.23 11.21,22.23 | 11.21,22.23 10.15,22.23 9.52,22.86 8.25,22.86 | v14.44,19.05 11.21,19.05 | 11.21,19.05 10.15,19.05 9.52,19.68 8.25,19.68 | v14.44,15.88 11.21,15.88 | 11.21,15.88 10.15,15.88 9.52,16.51 8.25,16.51
  Bottom 0.254: 11.21,12.7 v14.44,12.7 22.21,12.7 | 11.21,12.7 10.15,12.7 9.52,13.34 8.25,13.34 | v14.44,9.53 11.21,9.53 | 11.21,9.53 10.15,9.53 9.52,10.16 8.25,10.16 | v14.44,6.35 11.21,6.35 | 11.21,6.35 10.15,6.35 9.52,6.99 8.25,6.99 | v14.44,3.17 11.21,3.17 | 11.21,3.17 10.15,3.17 9.52,3.81 8.25,3.81 | v59.36,28.73 v54.28,28.73 48.25,28.73 | v71.27,37.47 64.76,37.47 | 64.76,37.47 v60.95,37.47 v56.98,37.47 52.7,37.47 v52.06,36.83 52.06,36.2 50.79,34.92 48.25,34.92 | C33.2 35.05,42.97 X2.2 35.05,40.64 | IC3.2 50.16,48.26 47.62,48.26 | 47.62,48.26 45.71,48.26 | 45.71,48.26 43.17,48.26 | IC2.2 43.17,48.26 | IC6.2 64.76,32.38 | 64.76,32.38 64.76,34.92 | R7.1 64.76,29.84 | 64.76,29.84 64.76,32.38 | 64.76,29.84 C36.2 | C1.2 45.71,48.26 | C6.2 40.63,48.26 | 40.63,48.26 43.17,48.26 | C2.2 40.63,48.26 | C37.2 64.76,34.92 | C5.2 47.62,48.26 | 64.76,34.92 64.76,37.47 | C18.2 C20.2 38.09,29.21 | R43.1 11.21,48.26 | R44.1 11.21,45.09 | R45.1 11.21,41.91 | R46.1 11.21,38.73 | R47.1 11.21,35.56 | R48.1 11.21,32.38 | R49.1 11.21,29.21 | R50.1 11.21,25.4 | R51.1 11.21,22.23 | R52.1 11.21,19.05 | R53.1 11.21,15.88 | R54.1 11.21,12.7 | R55.1 11.21,9.53 | R56.1 11.21,6.35 | R57.1 11.21,3.17 | R58.1 6.12,3.81 | v26.02,35.56 21.58,35.56 | 47.3,15.24 47.2,15.34 C13.2 C17.2 38.94,15.24 38.09,15.24 38.09,12.7 IC5.4 | 29.83,4.45 30.47,3.81 v39.36,3.81 47.3,3.81 | 29.83,4.45 v29.2,5.08 22.85,11.43 | 22.85,11.43 22.21,12.06 22.21,12.7 | 22.21,12.7 22.21,16.51 | 40.63,48.26 38.09,48.26 34.28,52.07 31.74,52.07 | 31.74,52.07 29.83,52.07 | 29.83,52.07 27.93,52.07 | 27.93,52.07 26.02,52.07 | 26.02,52.07 24.12,52.07 21.58,49.53 21.58,40.64 | C14.2 27.93,40.64 | 27.93,14.29 32.06,14.29 v32.38,14.61
  Bottom 0.254: C21.2 27.93,15.88 27.93,14.29 | C19.2 48.25,35.56 | 48.25,23.5 48.25,20 | 48.25,20 v48.57,20 | 47.3,15.24 47.3,3.81 | 47.3,3.81 48.89,3.81 70.44,25.37 X1.5 | 21.58,20.95 21.58,21.59 23.48,23.5 23.48,24.13 | 27.91,40.66 27.93,40.64 | 23.48,24.13 v25.71,24.13 | LED1.C 26.02,52.07 | LED2.C 27.93,52.07 | LED3.C 29.83,52.07 | LED4.C 31.74,52.07 | 64.76,34.92 C40.2 | 32.38,24.13 34.91,24.13 34.91,24.77 37.46,24.77 | 37.46,24.77 37.46,26.04 | 37.46,26.04 37.46,26.35 | C4.2 37.46,24.77 | C9.2 37.46,26.04 | Q3.2 22.85,6.33 22.85,11.43 | Q1.2 28.55,3.16 29.83,4.45
  pour Top (isolate 0.254): -0.01,0 76.19,0 76.19,53.34 -0.01,53.34
  pour Bottom (isolate 0.254): -0.01,0 76.19,0 76.19,53.34 -0.01,53.34
IO1  (via drill 0.5)
  Top 0.254: JP114.1 v4.12,49.53 R27.2
  Bottom 0.254: JP114.1 v4.12,49.53 R27.2
IO2  (via drill 0.5)
  Top 0.254: JP116.1 v4.12,46.99 R28.2
  Bottom 0.254: JP116.1 v4.12,46.99 R28.2
IO3  (via drill 0.5)
  Top 0.254: JP118.1 v4.12,44.45 R29.2
  Bottom 0.254: JP118.1 v4.12,44.45 R29.2
IO4  (via drill 0.5)
  Top 0.254: JP120.1 v4.12,41.91 R30.2
  Bottom 0.254: JP120.1 v4.12,41.91 R30.2
IO5  (via drill 0.5)
  Top 0.254: JP122.1 v4.12,39.37 R31.2
  Bottom 0.254: JP122.1 v4.12,39.37 R31.2
IO6  (via drill 0.5)
  Top 0.254: JP124.1 v4.12,36.83 R32.2
  Bottom 0.254: JP124.1 v4.12,36.83 R32.2
IO7  (via drill 0.5)
  Top 0.254: JP126.1 v4.12,34.29 R33.2
  Bottom 0.254: JP126.1 v4.12,34.29 R33.2
IO8  (via drill 0.5)
  Top 0.254: JP128.1 v4.12,31.75 R34.2
  Bottom 0.254: JP128.1 v4.12,31.75 R34.2
IO9  (via drill 0.5)
  Top 0.254: JP98.1 v4.12,24.13 R35.2
  Bottom 0.254: JP98.1 v4.12,24.13 R35.2
IO10  (via drill 0.5)
  Top 0.254: JP100.1 v4.12,21.59 R36.2
  Bottom 0.254: JP100.1 v4.12,21.59 R36.2
IO11  (via drill 0.5)
  Top 0.254: JP102.1 v4.12,19.05 R37.2
  Bottom 0.254: JP102.1 v4.12,19.05 R37.2
IO12  (via drill 0.5)
  Top 0.254: JP104.1 v4.12,16.51 R38.2
  Bottom 0.254: JP104.1 v4.12,16.51 R38.2
IO13  (via drill 0.5)
  Top 0.254: JP106.1 v4.12,13.97 R39.2
  Bottom 0.254: JP106.1 v4.12,13.97 R39.2
IO14  (via drill 0.5)
  Top 0.254: JP108.1 v4.12,11.43 R40.2
  Bottom 0.254: JP108.1 v4.12,11.43 R40.2
IO15  (via drill 0.5)
  Top 0.254: JP110.1 v4.12,8.89 R41.2
  Bottom 0.254: JP110.1 v4.12,8.89 R41.2
IO16  (via drill 0.5)
  Top 0.254: JP112.1 v4.12,6.35 R42.2
  Bottom 0.254: JP112.1 v4.12,6.35 R42.2
LED1  (via drill 0.5)
  Top 0.254: IC1.139 28.66,42.45 v26.02,45.09
  Bottom 0.254: R4.1 v26.02,45.09
LED2  (via drill 0.5)
  Top 0.254: IC1.138 29.16,43.85 v27.93,45.09
  Bottom 0.254: v27.93,45.09 R8.1
LED3  (via drill 0.5)
  Top 0.254: IC1.133 31.66,43.26 v29.83,45.09
  Bottom 0.254: v29.83,45.09 R9.1
M_A0
  Top 0.254: IC1.79 67.27,21.55 68.15,22.44 IC4.23
M_A1
  Top 0.254: IC1.78 68.03,21.05 68.95,21.97 IC4.24
M_A2
  Top 0.254: IC4.25 69.75,21.5 67.3,19.05 48.25,19.05 47.75,19.55 IC1.75
M_A3
  Top 0.254: IC4.26 70.55,21.03 67.93,18.41 47.62,18.41 46.98,19.05 IC1.74
M_A4
  Top 0.254: IC1.132 32.16,43.29 38.41,49.53 60.32,49.53 70.55,39.3 IC4.29
M_A5
  Top 0.254: IC1.102 65.43,33.05 69.75,37.38 IC4.30
M_A6
  Top 0.254: IC1.104 65.16,34.05 68.95,37.84 IC4.31
M_A7
  Top 0.254: IC1.131 32.66,42.84 38.73,48.9 59.44,48.9 68.15,40.19 IC4.32
M_A8
  Top 0.254: IC1.127 34.66,43.88 39.04,48.26 59.05,48.26 67.35,39.95 IC4.33
M_A9
  Top 0.254: IC1.126 35.16,43.43 39.36,47.62 58.81,47.62 66.55,39.8 IC4.34
M_A10
  Top 0.254: IC1.80 66.49,22.05 67.35,22.91 IC4.22
M_A11
  Top 0.254: IC1.124 36.16,43.48 39.68,46.99 58.41,46.99 65.75,39.65 IC4.35
M_A12
  Top 0.254: IC1.123 36.66,43.02 40,46.35 58.09,46.35 64.95,39.5 IC4.36
M_BA0
  Top 0.254: IC1.82 64.95,23.05 65.75,23.85 IC4.20
M_BA1
  Top 0.254: IC4.21 66.55,23.38 65.72,22.55 IC1.81
M_CAS
  Top 0.254: IC4.17 63.35,25.26 62.65,24.55 IC1.85
M_CKE
  Top 0.254: IC1.121 37.66,43.07 40.31,45.72 57.77,45.72 64.15,39.34 IC4.37
M_CLK
  Top 0.254: IC1.105 61.22,34.55 63.35,36.69 IC4.38
M_CS
  Top 0.254: IC1.83 64.18,23.55 64.95,24.32 IC4.19
M_DQ0
  Top 0.254: IC1.92 51.35,28.05 IC4.2
M_DQ1
  Top 0.254: IC4.4 52.95,28 52.4,28.55 IC1.93
M_DQ2
  Top 0.254: IC1.94 52.85,29.05 53.75,28.16 IC4.5
M_DQ3
  Top 0.254: IC1.95 54.89,29.55 55.35,29.09 IC4.7
M_DQ4
  Top 0.254: IC1.97 55.16,30.55 56.15,29.57 IC4.8
M_DQ5
  Top 0.254: IC1.98 55.93,31.05 57.75,29.23 IC4.10
M_DQ6
  Top 0.254: IC1.99 56.7,31.55 58.55,29.7 IC4.11
M_DQ7
  Top 0.254: IC1.100 57.47,32.05 60.15,29.38 IC4.13
M_DQ8
  Top 0.254: IC1.119 38.66,42.17 40.95,44.45 55.87,44.45 60.15,40.17 IC4.42
M_DQ9
  Top 0.254: IC1.118 39.16,41.72 41.27,43.81 55.23,43.81 58.55,40.5 IC4.44
M_DQ10
  Top 0.254: IC1.117 39.66,41.26 41.58,43.18 54.6,43.18 57.75,40.03 IC4.45
M_DQ11
  Top 0.254: IC1.116 40.16,40.81 41.9,42.55 53.97,42.55 56.15,40.36 IC4.47
M_DQ12
  Top 0.254: IC1.115 40.66,40.36 42.22,41.91 53.33,41.91 55.35,39.89 IC4.48
M_DQ13
  Top 0.254: IC1.114 41.16,39.91 42.54,41.27 52.7,41.27 53.75,40.22 IC4.50
M_DQ14
  Top 0.254: IC1.112 42.16,39.95 42.85,40.64 52.06,40.64 52.95,39.75 IC4.51
M_DQ15
  Top 0.254: IC1.111 42.66,39.5 43.17,40.01 50.79,40.01 51.35,39.45 IC4.53
M_DQMH
  Top 0.254: IC1.120 38.16,42.62 40.63,45.09 57.14,45.09 62.55,39.67 IC4.39
M_DQML
  Top 0.254: IC1.88 48.23,26.05 48.57,25.72 61.27,25.72 61.75,26.2 IC4.15
M_PWREN  (via drill 0.5)
  Top 0.254: IC1.101 66.39,32.55 v67.52,31.43
  Bottom 0.254: IC6.3 v67.52,31.43 R7.2
M_RAS
  Top 0.254: IC4.18 64.15,24.79 63.41,24.05 IC1.84
M_WE
  Top 0.254: IC1.87 47.14,25.55 47.62,25.08 61.9,25.08 62.55,25.73 IC4.16
N$1
  Bottom 0.254: C1.1 45.71,44.45 44.12,44.45 IC2.4
N$2
  Bottom 0.254: IC3.5 49.21,43.81 TP8.TP | C5.1 TP8.TP | L1.1 44.44,43.81 TP8.TP
N$3
  Bottom 0.254: IC2.5 42.22,45.51 | 42.22,45.51 C2.1 | L3.1 L2.1 TP9.TP 42.54,45.19 42.22,45.51
N$4
  Top 0.254: LED5.A 48.25,15.88 48.25,13.97 R59.2
N$5
  Bottom 0.254: LED1.A R4.2
N$6
  Bottom 0.254: IC6.4 62.01,31.43 C36.1
N$7
  Bottom 0.254: Q2.1 20.29,5.08 R60.1
N$8
  Top 0.254: TR1.4 8.56,52.38 8.56,49.53 R11.1
N$9
  Top 0.254: TR2.4 9.2,49.21 8.56,48.58 8.56,46.99 R12.1
N$10
  Top 0.254: TR3.4 9.83,46.03 8.25,44.45 R13.1
N$11
  Top 0.254: TR4.4 9.2,42.86 8.25,41.91 R14.1
N$12
  Top 0.254: TR5.4 8.56,39.69 8.25,39.37 R15.1
N$13
  Top 0.254: TR6.4 8.56,36.51 8.25,36.83 R16.1
N$14
  Top 0.254: TR7.4 9.2,33.34 8.25,34.29 R17.1
N$15
  Top 0.254: TR8.4 9.84,30.16 8.25,31.75 R18.1
N$16
  Top 0.254: TR9.4 8.56,26.35 7.19,24.98 R19.1
N$17
  Top 0.254: TR10.4 9.83,23.18 8.25,21.59 R20.1
N$18
  Top 0.254: TR11.4 9.2,20 8.25,19.05 R21.1
N$19
  Top 0.254: TR12.4 8.56,16.82 8.25,16.51 R22.1
N$20
  Top 0.254: TR13.4 8.56,13.65 8.25,13.97 R23.1
N$21
  Top 0.254: TR14.4 9.2,10.47 8.25,11.43 R24.1
N$22
  Top 0.254: TR15.4 9.84,7.3 8.25,8.89 R25.1
N$23
  Top 0.254: R26.1 7.19,5.5 8.56,4.12 TR16.4
N$24
  Bottom 0.254: Q1.3 25.12,5.08 R60.2
N$25
  Bottom 0.254: Q4.1 17.75,6.99 R61.1
N$26
  Bottom 0.254: R61.2 Q3.3
N$27
  Top 0.254: U$1.4 34.41,3.81 | 34.41,3.81 34.41,3.31 33.01,1.91 R63.2 26.24,2.75 26.44,2.96 R62.2 | C39.1 34.41,3.81
N$89
  Bottom 0.254: LED2.A R8.2
N$90
  Bottom 0.254: LED3.A R9.2
N$91
  Bottom 0.254: LED4.A 31.74,47.62 R10.2
RESET_N  (via drill 0.5)
  Top 0.254: IC1.37 26.16,16.02 v25.39,15.24 24.12,13.97 TP1.TP
  Bottom 0.254: R6.1 26.66,15.24 v25.39,15.24
S1
  Top 0.254: IC1.140 28.16,41.67 17.45,52.38 TR1.3
S2
  Top 0.254: IC1.142 27.16,40.13 18.09,49.21 TR2.3
S3
  Top 0.254: IC1.2 22.85,35.55 22.21,36.2 22.21,38.73 14.92,46.03 TR3.3
S4
  Top 0.254: IC1.6 22.31,33.55 19.67,36.2 19.67,38.1 14.92,42.86 TR4.3
S5
  Top 0.254: TR5.3 14.92,39.69 17.13,37.47 17.13,36.2 20.77,32.55 IC1.8
S6
  Top 0.254: TR6.3 14.92,36.51 15.87,35.56 15.87,34.92 19.23,31.55 IC1.10
S7
  Top 0.254: TR7.3 14.92,33.34 17.69,30.55 IC1.12
S8
  Top 0.254: IC1.15 16.65,29.05 15.55,30.16 TR8.3
S9
  Top 0.254: TR9.3 14.99,26.35 15.29,26.05 IC1.21
S10
  Top 0.254: TR10.3 15.54,23.18 17.42,25.05 IC1.23
S11
  Top 0.254: TR11.3 14.91,20 18.46,23.55 IC1.26
S12
  Top 0.254: TR12.3 16.18,16.82 16.82,17.46 16.82,19.37 19.5,22.05 IC1.29
S13
  Top 0.254: TR13.3 15.54,13.65 18.72,16.83 18.72,18.73 20.54,20.55 IC1.32
S14
  Top 0.254: TR14.3 15.54,10.47 20.63,15.56 20.63,18.1 22.08,19.55 IC1.34
S15
  Top 0.254: IC1.39 27.16,13.21 23.8,9.84 23.48,9.53 21.26,7.3 TR15.3
S16
  Top 0.254: IC1.41 28.16,11.66 20.62,4.12 TR16.3
SD1  (via drill 0.5)
  Top 0.254: TR1.5 10.15,51.44 v9.52,50.8 | IC1.141 27.66,40.91 18.4,50.16 v15.23,50.16
  Bottom 0.254: v9.52,50.8 10.15,50.16 12.9,50.16 | 12.9,50.16 v15.23,50.16 | R43.2 12.9,50.16
SD2  (via drill 0.5)
  Top 0.254: TR2.5 10.15,48.26 v9.52,47.62 | IC1.143 26.66,39.37 19.04,46.99 v18.4,46.99
  Bottom 0.254: v9.52,47.62 10.15,46.99 12.9,46.99 | 12.9,46.99 v18.4,46.99 | R44.2 12.9,46.99
SD3  (via drill 0.5)
  Top 0.254: TR3.5 10.15,45.09 v9.52,44.45 | IC1.5 23.08,34.05 20.94,36.2 20.94,38.1 v15.23,43.81
  Bottom 0.254: v9.52,44.45 10.15,43.81 12.9,43.81 | v15.23,43.81 13.33,43.81 12.9,43.81 | R45.2 12.9,43.81
SD4  (via drill 0.5)
  Top 0.254: TR4.5 10.15,41.91 v9.52,41.27 | 15.55,40.32 v15.23,40.64 18.4,37.47 18.4,36.2 21.54,33.05 IC1.7
  Bottom 0.254: v9.52,41.27 10.15,40.64 12.9,40.64 | v15.23,40.64 13.96,40.64 12.9,40.64 | R46.2 12.9,40.64
SD5  (via drill 0.5)
  Top 0.254: TR5.5 10.15,38.73 v9.52,38.1 | IC1.9 20,32.05 16.5,35.56 16.5,36.2 v15.23,37.47
  Bottom 0.254: v9.52,38.1 10.15,37.47 12.9,37.47 | v15.23,37.47 13.33,37.47 12.9,37.47 | R47.2 12.9,37.47
SD6  (via drill 0.5)
  Top 0.254: TR6.5 10.15,35.56 v9.52,34.92 | IC1.11 18.46,31.05 v15.23,34.29
  Bottom 0.254: v9.52,34.92 10.15,34.29 12.9,34.29 | v15.23,34.29 13.33,34.29 12.9,34.29 | R48.2 12.9,34.29
SD7  (via drill 0.5)
  Top 0.254: IC1.14 17.42,29.55 15.87,31.11 v15.23,31.11 | TR7.5 10.15,32.38 v9.52,31.75
  Bottom 0.254: v9.52,31.75 10.15,31.11 12.9,31.11 | v15.23,31.11 13.33,31.11 12.9,31.11 | R49.2 12.9,31.11
SD8  (via drill 0.5)
  Top 0.254: IC1.16 15.85,28.55 v15.87,28.57 | TR8.5 10.15,29.21 v9.52,28.57
  Bottom 0.254: v9.52,28.57 10.15,27.94 12.9,27.94 | R50.2 12.9,27.94 | 12.9,27.94 15.23,27.94 v15.87,28.57
SD9  (via drill 0.5)
  Top 0.254: TR9.5 10.15,25.4 v9.52,24.77 | v15.23,24.13 16.65,25.55 IC1.22
  Bottom 0.254: v9.52,24.77 10.15,24.13 12.9,24.13 | 12.9,24.13 v15.23,24.13 | R51.2 12.9,24.13
SD10  (via drill 0.5)
  Top 0.254: TR10.5 10.15,22.23 v9.52,21.59 | IC1.24 18.19,24.55 v15.87,22.23
  Bottom 0.254: v9.52,21.59 10.15,20.95 12.9,20.95 | R52.2 12.9,20.95 | 12.9,20.95 14.6,20.95 v15.87,22.23
SD11  (via drill 0.5)
  Top 0.254: TR11.5 10.15,19.05 v9.52,18.41 | IC1.27 19.23,23.05 15.87,19.68 15.87,18.41 v15.23,17.78
  Bottom 0.254: v9.52,18.41 10.15,17.78 12.9,17.78 | 12.9,17.78 v15.23,17.78 | R53.2 12.9,17.78
SD12  (via drill 0.5)
  Top 0.254: TR12.5 10.15,15.88 v9.52,15.24 | v15.23,14.61 17.77,17.14 17.77,19.05 20.27,21.55 IC1.30
  Bottom 0.254: v9.52,15.24 10.15,14.61 12.9,14.61 | 12.9,14.61 v15.23,14.61 | R54.2 12.9,14.61
SD13  (via drill 0.5)
  Top 0.254: TR13.5 10.15,12.7 v9.52,12.06 | v14.91,11.43 19.67,16.19 19.67,18.41 21.31,20.05 IC1.33
  Bottom 0.254: v9.52,12.06 10.15,11.43 12.9,11.43 | R55.2 12.9,11.43 | 12.9,11.43 v14.91,11.43
SD14  (via drill 0.5)
  Top 0.254: TR14.5 10.15,9.53 v9.52,8.89 | IC1.35 22.85,19.05 21.58,17.78 21.58,14.61 v18.4,11.43
  Bottom 0.254: v9.52,8.89 10.15,8.26 12.9,8.26 | R56.2 12.9,8.26 | 12.9,8.26 15.23,8.26 v18.4,11.43
SD15  (via drill 0.5)
  Top 0.254: TR15.5 10.15,6.35 v9.52,5.71 | IC1.40 27.66,12.44 20.31,5.08 v15.23,5.08
  Bottom 0.254: v9.52,5.71 10.15,5.08 12.9,5.08 | 12.9,5.08 v15.23,5.08 | R57.2 12.9,5.08
SD16  (via drill 0.5)
  Top 0.254: TR16.5 10.15,3.17 v9.52,2.54 | IC1.43 29.16,11.39 19.67,1.91 v16.5,1.91
  Bottom 0.254: v16.5,1.91 10.15,1.91 v9.52,2.54 arc-90 9.2,2.22 R58.2
TCK  (via drill 0.5)
  Top 0.254: IC1.109 v46.34,38.1 | TP14.TP v71.74,49.53
  Bottom 0.254: v46.34,38.1 57.77,49.53 v71.74,49.53
TDI  (via drill 0.5)
  Top 0.254: v48.25,38.1 46.98,39.37 43.49,39.37 43.16,39.05 IC1.110 | TP15.TP v71.74,46.99
  Bottom 0.254: v48.25,38.1 57.14,46.99 v71.74,46.99
TDO  (via drill 0.5)
  Top 0.254: IC1.106 49.02,35.05 v50.16,36.2 | TP16.TP v71.74,41.91
  Bottom 0.254: v50.16,36.2 55.87,41.91 v71.74,41.91
TMS  (via drill 0.5)
  Top 0.254: IC1.107 47.61,35.55 v48.89,36.83 | TP13.TP v71.74,44.45
  Bottom 0.254: v48.89,36.83 56.51,44.45 v71.74,44.45
USB_D+
  Top 0.254: IC1.59 37.16,15.21 37.77,14.61 R2.2
USB_D-
  Top 0.254: IC1.56 35.66,15.36 35.23,14.92 R1.2
USB_PUP
  Top 0.254: IC1.67 41.16,14.07 41.42,13.81 R3.2
USB_S+  (via drill 0.5)
  Top 0.254: v51.43,8.89 41.42,8.89 | 41.42,8.89 38.73,8.89 36.66,10.95 36.66,11.85 | IC1.58 36.66,11.85 | 36.66,11.85 R2.1 | R3.1 41.42,8.89
  Bottom 0.254: v51.43,8.89 69.2,26.67 X1.3
USB_S-  (via drill 0.5)
  Top 0.254: v49.2,7.94 38.39,7.94 36.16,10.16 36.16,11.85 | IC1.57 36.16,11.85 | 36.16,11.85 R1.1
  Bottom 0.254: v49.2,7.94 68.58,27.32 X1.2
VCC_B1  (via drill 0.5)
  Top 0.254: JP4.1 v4.12,29.21 5.71,27.62 11.82,27.62 11.82,28.26 | TR1.6 11.82,50.48 11.82,47.31 | TR2.6 11.82,47.31 | TR3.6 11.82,44.13 | 11.82,44.13 11.82,47.31 | TR4.6 11.82,40.96 | 11.82,40.96 11.82,44.13 | TR5.6 11.82,37.78 | 11.82,37.78 11.82,40.96 | TR6.6 11.82,34.61 | 11.82,34.61 11.82,37.78 | TR7.6 11.82,31.43 | 11.82,31.43 11.82,34.61 | TR8.6 11.82,28.26 | 11.82,28.26 11.82,31.43
  Bottom 0.254: JP4.1 v4.12,29.21 C34.1
VCC_B2  (via drill 0.5)
  Top 0.254: 11.82,24.45 11.82,21.27 | TR10.6 11.82,21.27 | TR11.6 11.82,18.1 | 11.82,18.1 11.82,21.27 | TR12.6 11.82,14.93 | 11.82,14.93 11.82,18.1 | TR13.6 11.82,11.75 | 11.82,11.75 11.82,14.93 | TR14.6 11.82,8.57 | 11.82,8.57 11.82,11.75 | TR15.6 11.82,5.4 | 11.82,5.4 11.82,8.57 | TR16.6 11.82,2.23 | 11.82,2.23 11.82,5.4 | JP2.1 v4.12,26.67 4.59,27.15 11.82,27.15 11.82,24.45 | TR9.6 11.82,24.45 | 11.82,2.23 11.82,1.51 12.69,0.64 21.58,0.64 v22.85,1.91 R63.1
  Bottom 0.254: JP2.1 v4.12,26.67 C35.1 | Q4.3 Q2.3 22.58,1.64 v22.85,1.91
VCC_MEM  (via drill 0.5)
  Top 0.254: IC4.1 50.55,26.35 52.15,26.35 | IC4.3 52.15,26.35 | IC4.9 56.95,26.35 | 56.95,26.35 52.15,26.35 | 56.95,26.35 60.95,26.35 IC4.14 v60.95,28.57 71.35,28.57 IC4.27 | IC4.49 54.55,36.88 55.23,36.2 v58.41,36.2 59.35,37.13 IC4.43
  Bottom 0.254: TP3.TP C37.1 | TP3.TP 60.32,33.34 | 60.32,33.34 60.32,29.21 v60.95,28.57 | IC6.5 60.32,33.34 | TP3.TP 60.32,36.2 v58.41,36.2 | C41.1 57.77,33.34 | 57.77,33.34 60.32,33.34 | C42.1 55.23,33.34 | 55.23,33.34 57.77,33.34 | C43.1 54.29,32.38 55.23,33.34
VCCINT  (via drill 0.5)
  Top 0.254: IC1.19 25.8,27.05 26.18,26.67 v26.98,26.67 | IC1.28 v26.98,22.55 | IC1.128 v34.16,35.24 | IC1.89 v42.85,26.55 | IC1.52 33.66,17.76 v33.33,18.1
  Bottom 0.254: 38.09,35.24 v34.16,35.24 32.69,35.24 32.38,34.92 28.25,34.92 27.29,33.97 27.29,28.57 26.98,28.26 v26.98,26.67 26.98,25.4 27.29,25.08 27.29,23.18 26.98,22.86 v26.98,22.55 26.98,21.91 29.52,19.37 32.06,19.37 v33.33,18.1 33.65,17.78 35.55,17.78 37.46,19.68 40.63,19.68 42.85,21.91 v42.85,26.55 42.85,35.56 | 38.09,35.24 40,35.24 C18.1 | C20.1 38.09,35.24 | 42.85,35.56 42.85,36.51 44.44,38.1 L1.2 | C19.1 42.85,35.56
VCCIO  (via drill 0.5)
  Top 0.254: IC1.36 26.16,18.55 v29.2,21.59 | IC1.20 25.5,26.55 26.34,25.72 v27.93,25.72 | IC1.129 33.66,36.53 33.01,35.88 v33.01,33.97 | IC1.90 43.74,27.05 43.17,27.62 v41.9,27.62 | IC1.53 34.16,19.16 v34.12,19.21
  Bottom 0.254: 32.38,20.32 30.47,20.32 v29.2,21.59 27.93,22.86 27.93,24.13 | 27.93,24.13 v27.93,25.72 27.93,29.53 | 27.93,29.53 27.93,33.02 28.88,33.97 31.74,33.97 | 31.74,33.97 v33.01,33.97 36.19,33.97 C10.1 | 41.9,29.21 v41.9,27.62 41.9,26.04 | 41.9,29.21 41.9,36.83 42.54,37.47 L2.2 | C11.1 41.9,29.21 | C8.1 31.74,33.97 | C3.1 27.93,29.53 | C7.1 32.38,20.32 | C12.1 27.93,24.13 | 32.38,20.32 33.01,20.32 v34.12,19.21 34.28,19.05 36.19,20.95 37.46,20.95 | 41.9,26.04 41.9,22.86 40,20.95 37.46,20.95 | C4.1 37.46,20.95 | C9.1 41.9,26.04
VIO33  (via drill 0.5)
  Top 0.254: IC1.44 29.66,9.99 v26.02,6.35
  Bottom 0.254: Q3.1 24.74,7.63 v26.02,6.35
VIO50  (via drill 0.5)
  Top 0.254: IC1.45 30.16,8.59 v27.29,5.71
  Bottom 0.254: Q1.1 26.92,5.34 v27.29,5.71
(copper drawn outside any net)
  shapes: Bottom circle x2, Top circle x7

## Text on the board
Top: TCK | TDI | TMS | omicron | v2.0